# Altium schematic sheet Bluetooth.SchDoc
size A4
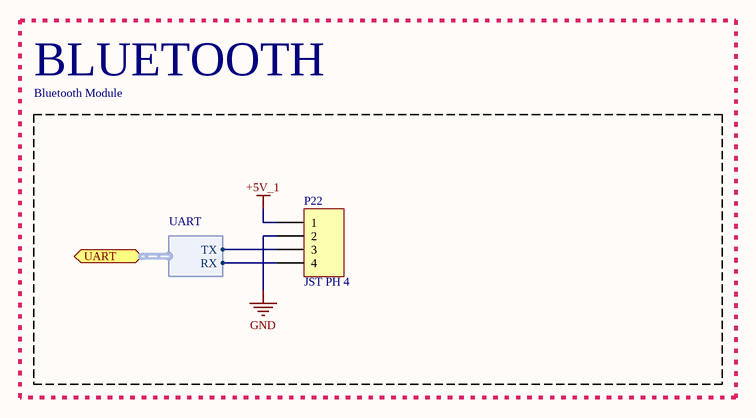
[diagram p0: Bluetooth.SchDoc]

## Parts
P22  JST PH 4  [B4B-PH-K]

## Blocks framed on the sheet
Bluetooth Module: P22

## Ports
UART (harness UART)

## Harnesses
UART: RX, TX

## Nets
+5V_1: P22.1
GND: P22.2
NetP22_3: P22.3 ; port UART.TX
NetP22_4: P22.4 ; port UART.RX

## Notes on the sheet
- BLUETOOTH